# EAGLE schematic control_power (EAGLE 5.10)
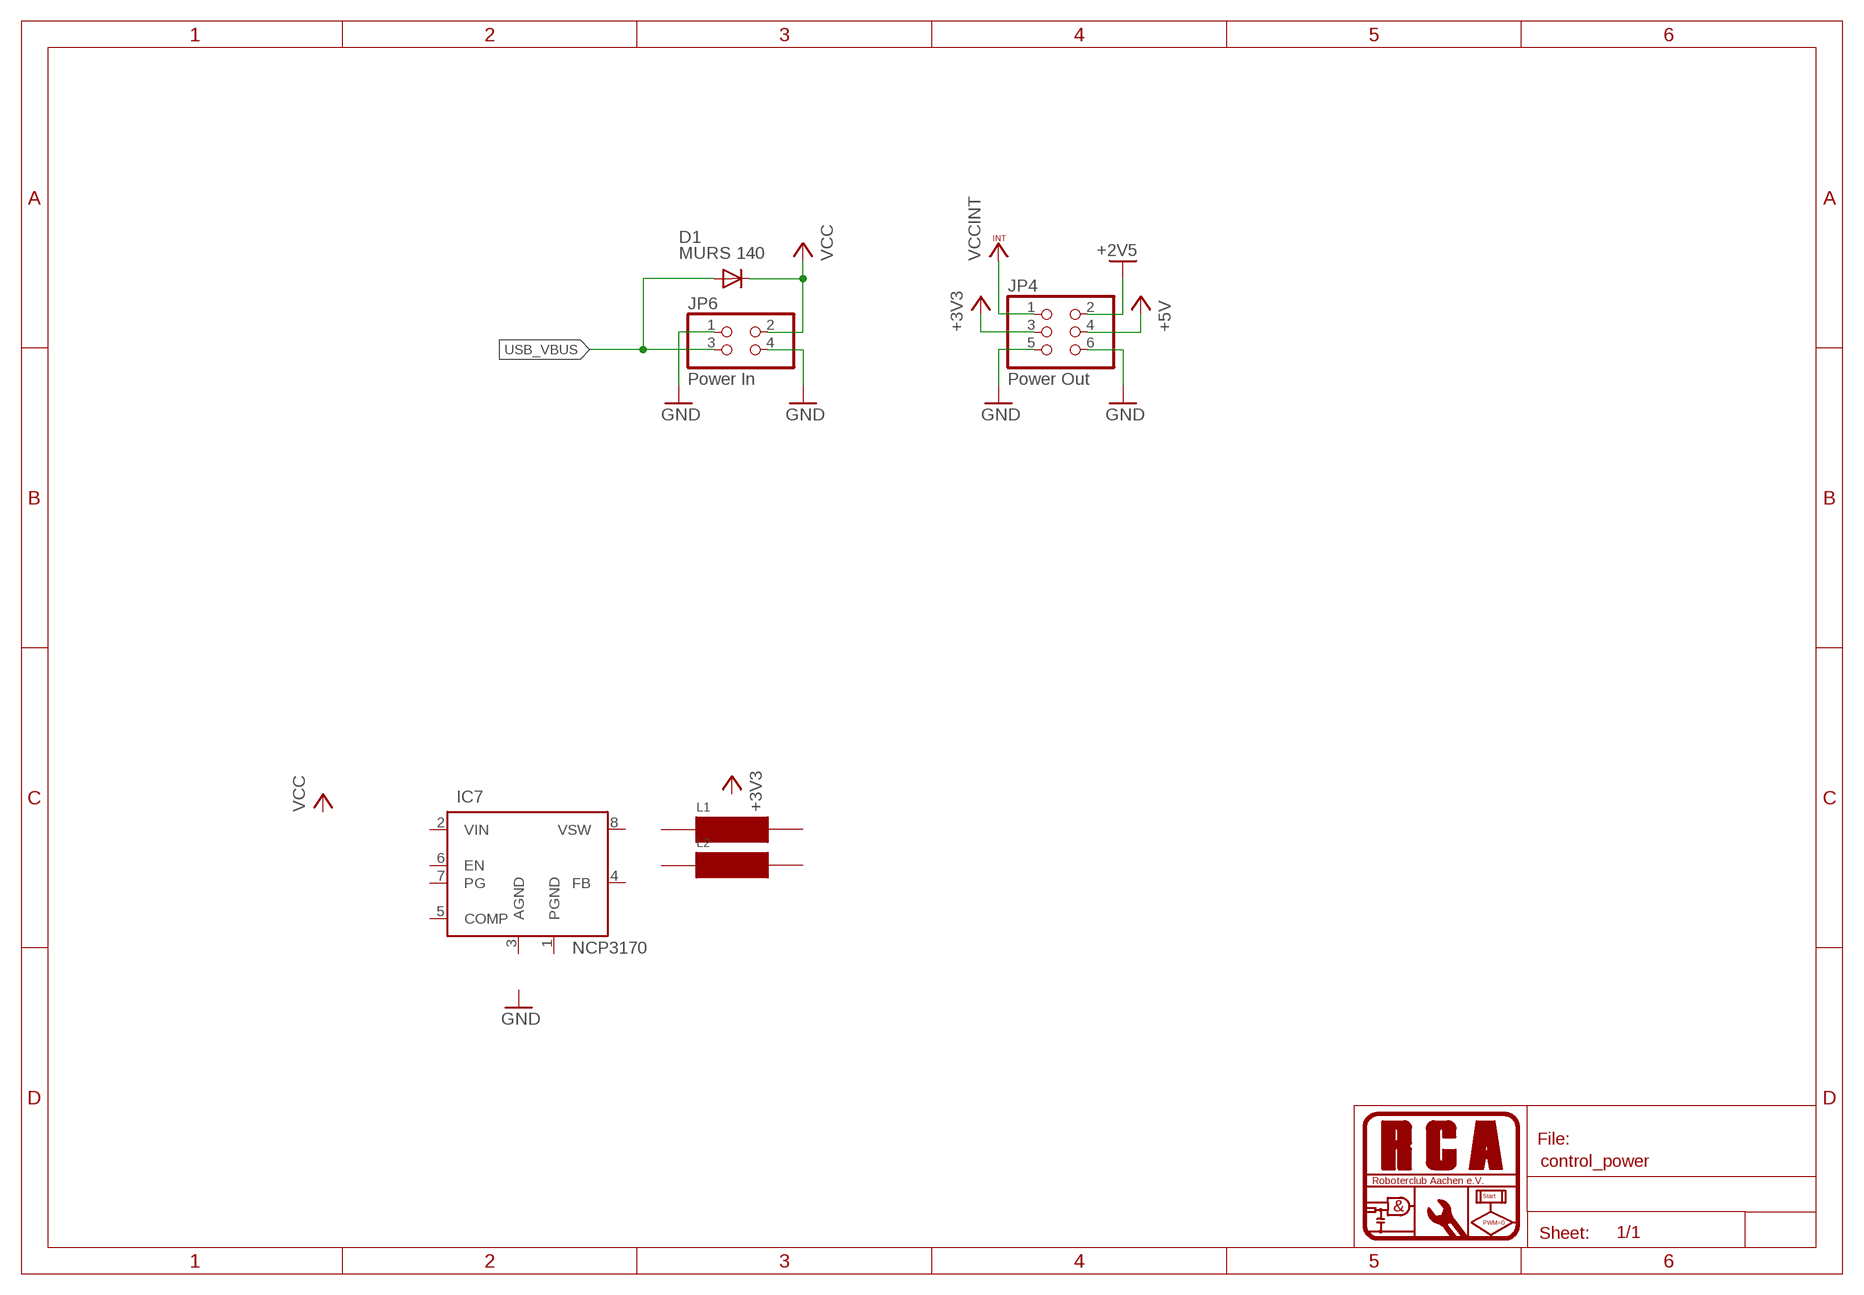
[diagram p0: schematic, sheet 1]

## Parts
D1  MURS 140  DIODE-SMB  [SMB]
IC7  NCP3170  [SO08]
JP4  Power Out  PINHD-2X3_2.54  [2X03]
JP6  Power In  PINHD-2X2_2.54  [2X02]
L1  INDUCTOR-PISM  [L-PISM]
L2  INDUCTOR-PIS28XX  [L-PIS28XX]

## Nets
+2V5: JP4.2
+3V3: JP4.3
+5V: JP4.4
GND: JP4.5 JP4.6 JP6.1 JP6.4
USB_VBUS: D1.A JP6.3
VCC: D1.C JP6.2
VCCINT: JP4.1
Unconnected: IC7.1(PGND) IC7.2(VIN) IC7.3(AGND) IC7.4(FB) IC7.5(COMP) IC7.6(EN) IC7.7(PG) IC7.8(VSW) L1.1 L1.2 L2.1 L2.2

## Library data of the parts
D1 = diode:DIODE-: DIODE
IC7 = rca_spgversorgung:NCP3170: Synchronous PWM Switching Converter The NCP3170 is a flexible synchronous PWM Switching Buck Regulator. The NCP3170 operates from 4.5V to 18V, sourcing up to 3A and is capable of producing output voltages as low as 0.8V. The NCP3170 also incorporates current mode control. To reduce the number of external components, a number of features are internally set including soft start, power good detection, and switching frequency. The NCP3170 is currently available in an SOIC-8 package.
JP4 = pinhead2:PINHD-2X3: PIN HEADER
JP6 = pinhead2:PINHD-2X2: PIN HEADER
L1 L2 = rca_sontiges:INDUCTOR: SMD-Power-Induktivitäten z.B. PISM, Ferrit, 150µ, Reichelt Bestellnr.: L-PISM 150µ